# EAGLE design control (EAGLE 6.3)
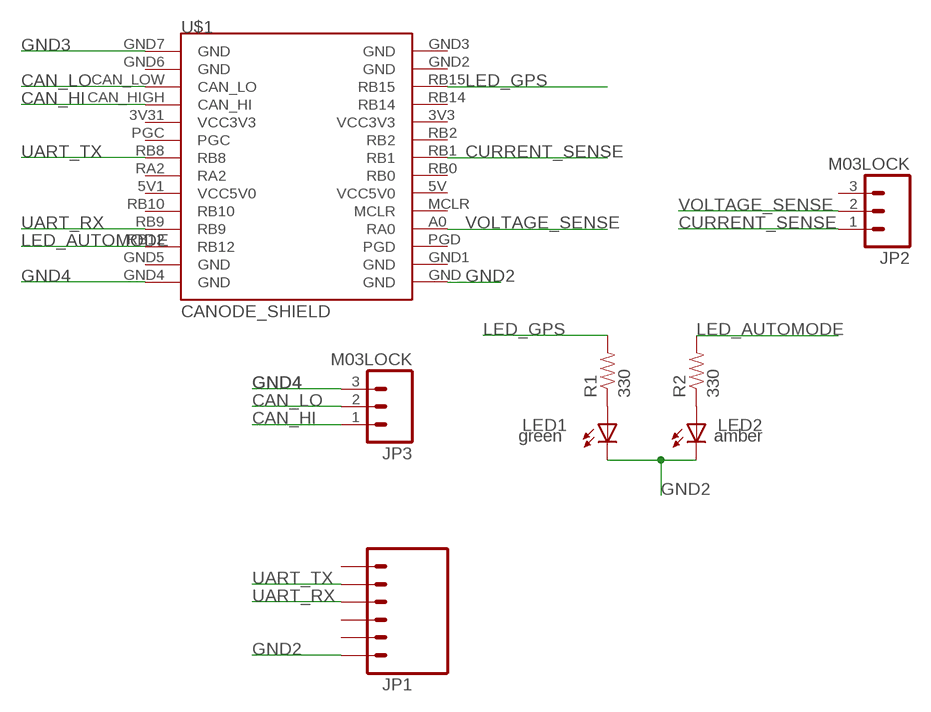
[diagram p0: schematic, sheet 1]

## Parts
JP1  M06LOCK  [1X06_LOCK]
JP2  M03LOCK  [1X03_LOCK]
JP3  M03LOCK  [1X03_LOCK]
LED1  LED1206  [LED-1206]
LED2  LED1206  [LED-1206]
R1  330  RESISTOR0805-RES  [0805]
R2  330  RESISTOR0805-RES  [0805]
U$1  CANODE_SHIELD  [CANODE_SHIELD]

## Nets
CAN_HI [small]: JP3.1 U$1.CAN_HIGH(CAN_HI)
CAN_LO: JP3.2 U$1.CAN_LOW(CAN_LO)
CURRENT_SENSE: JP2.1 U$1.RB1
GND2: JP1.1 LED1.C LED2.C U$1.GND
GND3: U$1.GND7(GND)
GND4: JP3.3 U$1.GND4(GND)
LED_AUTOMODE [small]: R2.2 U$1.RB12
LED_GPS: R1.2 U$1.RB15
N$1: LED1.A R1.1
N$2: LED2.A R2.1
UART_RX: JP1.4 U$1.RB9
UART_TX: JP1.5 U$1.RB8
VOLTAGE_SENSE: JP2.2 U$1.A0(RA0)
Unconnected: JP1.2 JP1.3 JP1.6 JP2.3 U$1.3V3(VCC3V3) U$1.3V31(VCC3V3) U$1.5V1(VCC5V0) U$1.5V(VCC5V0) U$1.GND1(GND) U$1.GND2(GND) U$1.GND3(GND) U$1.GND5(GND) U$1.GND6(GND) U$1.MCLR U$1.PGC U$1.PGD U$1.RA2 U$1.RB0 U$1.RB2 U$1.RB10 U$1.RB14

## Library data of the parts
JP1 = ASL:M06: Header 6 Standard 6-pin 0.1" header. Use with straight break away headers (SKU : PRT-00116), right angle break away headers (PRT-00553), swiss pins (PRT-00743), machine pins (PRT-00117), and female headers (PRT-00115). Molex polarized connector foot print use with SKU : PRT-08094 with associated crimp pins and housings. NOTES ON THE VARIANTS LOCK and LOCK_LONGPADS... This footprint was designed to help hold the alignment of a through-hole component (i.e. 6-pin header) while soldering it into place. You may notice that each hole has been shifted either up or down by 0.005 of an inch from it's more standard position (which is a perfectly straight line). This slight alteration caused the pins (the squares in the middle) to touch the edges of the holes. Because they are alternating, it causes a "brace" to hold the component in place. 0.005 has proven to be the perfect amount of "off-center" position when using our standard breakaway headers. Although looks a little odd when you look at the bare footprint, once you have a header in there, the alteration is very hard to notice. Also, if you push a header all the way into place, it is covered up entirely on the bottom side. This idea of altering the position of holes to aid alignment will be further integrated into the Sparkfun Library for other footprints. It can help hold any component with 3 or more connection pins.
JP2 JP3 = ASL:M03: Header 3 Standard 3-pin 0.1" header. Use with straight break away headers (SKU : PRT-00116), right angle break away headers (PRT-00553), swiss pins (PRT-00743), machine pins (PRT-00117), and female headers (PRT-00115). Molex polarized connector foot print use with SKU : PRT-08232 with associated crimp pins and housings.
LED1 = ASL:LED: LEDs Standard schematic elements and footprints for 5mm, 3mm, 1206, and 0603 sized LEDs. 5mm - Spark Fun Electronics SKU : COM-00529 (and others); COLOR: green
LED2 = ASL:LED: LEDs Standard schematic elements and footprints for 5mm, 3mm, 1206, and 0603 sized LEDs. 5mm - Spark Fun Electronics SKU : COM-00529 (and others); COLOR: amber
R1 R2 = ASL:RESISTOR: Resistor Basic schematic elements and footprints for 0603, 1206, and PTH resistors.
U$1 = ASL:CANODE_SHIELD: This part provides an outline of the CANode to facilitate developing shield boards. Note that this does not show the position of the mounting holes for the 4-40 screws, which should be .12" holes centered in the 4 circles in the corners.

## Net classes
0 default: width 0.406 mm
1 power: width 0.762 mm
2 small: width 0.203 mm

## Board
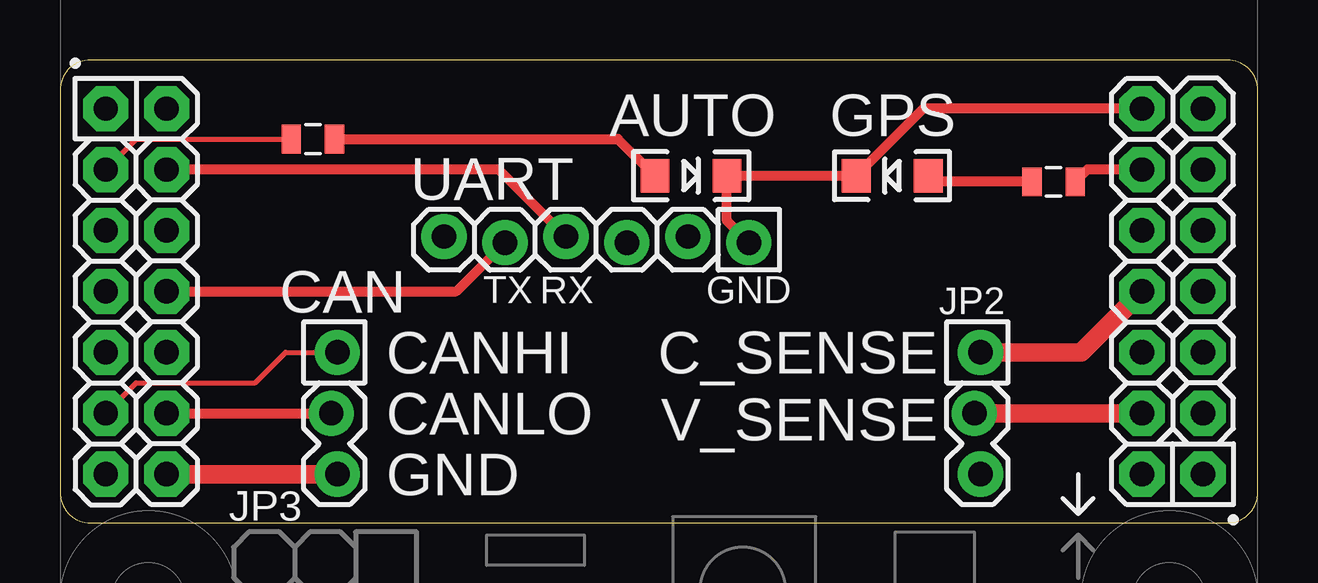
[diagram p1: board, top side]

Size 49.91 x 19.3 mm. Coordinates in mm from the lower left corner, seen from the top.
Outline: 0,18.03 0,1.27 arc90 1.27,0 48.64,0 arc90 49.91,1.27 49.91,18.03 arc90 48.64,19.3 1.27,19.3 arc90 0,18.03
Copper layers (1*16): Top 0.035mm / dielectric 1.5mm / Bottom 0.035mm
Design rules "default *": minimum track width 8mil, minimum drill 24mil, track to track 8mil, track to pad 8mil, pad to pad 8mil, via to via 8mil, smd to smd 8mil, copper to edge 30mil, drill to drill 8mil, minimum pad ring 10mil, minimum via ring 8mil, stop-mask expansion 4mil, vias tented up to drill 0mil, thermal gap 10mil

### Footprints (pad centres in the part's own frame; a part is rotated, then mirrored left to right if it is on the bottom)
1X06_LOCK = drill 1.016 pad 1.88: 1 0,0.127; 2 2.54,-0.127; 3 5.08,0.127; 4 7.62,-0.127; 5 10.16,0.127; 6 12.7,-0.127
1X03_LOCK = drill 1.016 pad 1.88: 1 0,0.127; 2 2.54,-0.127; 3 5.08,0.127
LED-1206 = smd 1.2 x 1.4: A -1.5,0; C 1.5,0
0805 = smd 0.8 x 1.2: 1 -0.9,0; 2 0.9,0
CANODE_SHIELD = drill 1.016 pad 1.88 octagon: 3V3 45.085,19.05; 3V31 4.445,13.97; 5V 45.085,13.97; 5V1 4.445,19.05; A0 45.085,11.43; CAN_HIGH 1.905,11.43; CAN_LOW 4.445,11.43; GND 45.085,24.13; GND1 47.625,24.13; GND2 45.085,8.89; GND3 47.625,8.89; GND4 4.445,8.89; GND5 1.905,8.89; GND6 4.445,24.13; GND7 1.905,24.13; MCLR 47.625,13.97; PGC 1.905,13.97; PGD 47.625,11.43; RA2 1.905,16.51; RB0 47.625,16.51; RB1 45.085,16.51; RB2 47.625,19.05; RB8 4.445,16.51; RB9 4.445,21.59; RB10 1.905,19.05; RB12 1.905,21.59; RB14 47.625,21.59; RB15 45.085,21.59

### Placement (x,y rotation side)
JP1  28.7,11.81 180 top
JP2  38.23,7.11 270 top
JP3  11.43,7.11 270 top
LED1  34.67,14.48 180 top
LED2  26.29,14.48 0 top
R1  41.4,14.22 0 top
R2  10.54,16 180 top
U$1  0,-6.86 0 top

### Tracks (layer width: path | path; a pad name or v marks a point on that pad's centre or on a via)
CAN_HI
  Top 0.203: U$1.CAN_HIGH 3.17,5.84 8.13,5.84 9.4,7.11 JP3.1
CAN_LO
  Top 0.406: U$1.CAN_LOW JP3.2
CURRENT_SENSE
  Top 0.762: JP2.1 42.55,7.11 U$1.RB1
GND2
  Top 0.406: U$1.GND 35.97,17.27 LED1.C LED2.C 27.79,12.6 JP1.1
GND4
  Top 0.762: JP3.3 U$1.GND4
LED_AUTOMODE
  Top 0.203: U$1.RB12 3.17,16 R2.2
LED_GPS
  Top 0.406: U$1.RB15 42.81,14.73 R1.2
N$1
  Top 0.406: R1.1 35.97,14.22 LED1.A
N$2
  Top 0.406: R2.1 23.24,16 LED2.A
UART_RX
  Top 0.406: U$1.RB9 18.29,14.73 JP1.4
UART_TX
  Top 0.406: U$1.RB8 16.51,9.65 JP1.5
VOLTAGE_SENSE
  Top 0.762: U$1.A0 JP2.2

### Text on the board
tPlace: AUTO | GPS | UART | TX | RX | GND | CAN | C_SENSE | CANHI | V_SENSE | CANLO | GND